# EAGLE schematic cat_detector (EAGLE 9.6.2)
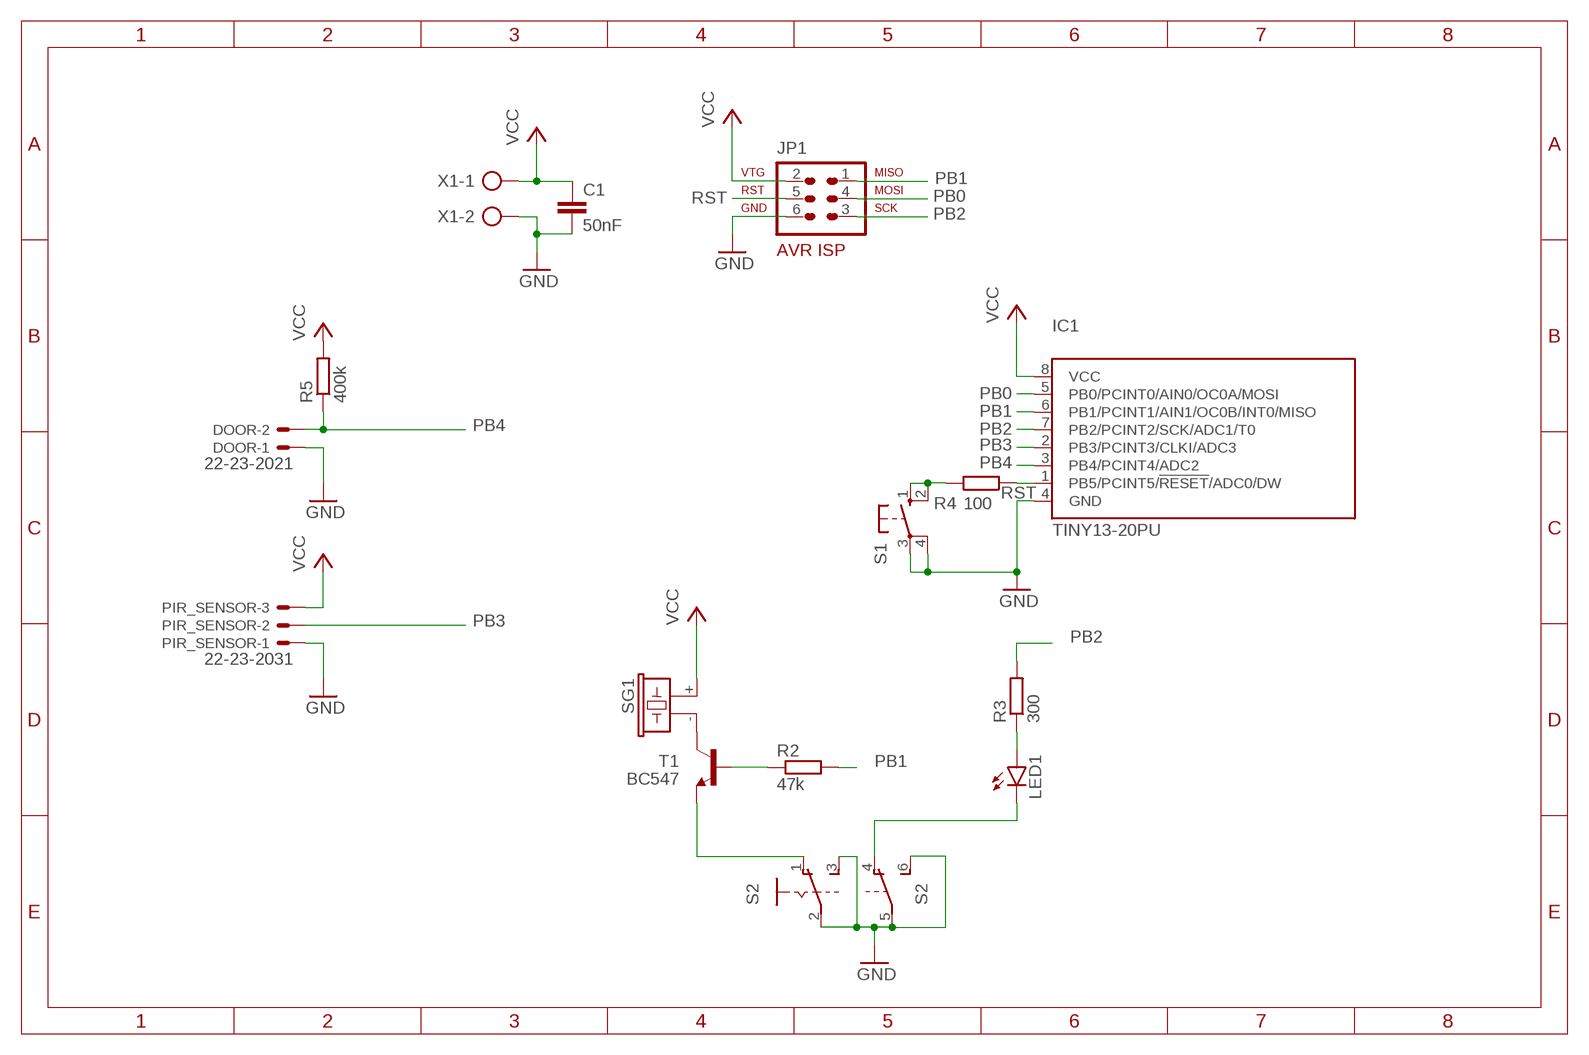
[diagram p0: schematic, sheet 1]

## Parts
C1  50nF  C2.5/2  [C2.5-2]
DOOR  22-23-2021  [22-23-2021]
IC1  TINY13-20PU  [DIL08]
JP1  AVR-ISP-6  [AVR-ISP-6]
LED1  LED5MM  [LED5MM]
PIR_SENSOR  22-23-2031  [22-23-2031]
R2  47k  R-EU_0204/7  [0204/7]
R3  300  R-EU_0204/7  [0204/7]
R4  100  R-EU_0204/7  [0204/7]
R5  400k  R-EU_0204/7  [0204/7]
S1  10-XX  [B3F-10XX]
S2  A68-A31  [A68-A31]
SG1  F/CM12P  [F/CM12P]
T1  BC547  [TO92]
X1  CON-PTR500_AK300/2  [CON-PTR500_AK300/2]

## Nets
GND: C1.2 DOOR.1 IC1.4(GND) JP1.6 PIR_SENSOR.1 S1.3(P) S1.4(P1) S2.2(A:P) S2.3(A:S) S2.5(B:P) S2.6(B:S) X1.2
N$2: SG1.- T1.3(C)
N$3: R2.1 T1.2(B)
N$4: LED1.A R3.1
N$5: S2.1(A:O) T1.1(E)
N$6: LED1.K(C) S2.4(B:O)
PB0: IC1.5(PB0/PCINT0/AIN0/OC0A/MOSI) JP1.4
PB1: IC1.6(PB1/PCINT1/AIN1/OC0B/INT0/MISO) JP1.1 R2.2
PB2: IC1.7(PB2/PCINT2/SCK/ADC1/T0) JP1.3 R3.2
PB3: IC1.2(PB3/PCINT3/CLKI/ADC3) PIR_SENSOR.2
PB4: DOOR.2 IC1.3(PB4/PCINT4/ADC2) R5.1
RST: IC1.1(PB5/PCINT5/!RESET!/ADC0/DW) JP1.5 R4.1
RST1: R4.2 S1.1(S) S1.2(S1)
VCC: C1.1 IC1.8(VCC) JP1.2 PIR_SENSOR.3 R5.2 SG1.+ X1.1

## Library data of the parts
C1 = capacitor-wima:C: CAPACITOR naming: grid - package width
DOOR = con-molex:22-23-2021: .100" (2.54mm) Center Header - 2 Pin; MF: MOLEX; MPN: 22-23-2021; OC_FARNELL: 1462926; OC_NEWARK: 25C3832
IC1 = atmel:TINY13: 8-bit AVR Microcontroller with 1K Bytes In-System Programmable Flash Source: http://www.atmel.com/dyn/resources/prod_documents/2535S.pdf; MPN: ATTINY13-20PU; OC_FARNELL: 9171550; OC_NEWARK: 96K6521
JP1 = atmel:AVR-ISP-6: AVR ISP-6 Serial Programming Header
LED1 = led:LED: LED OSRAM: - CHIPLED LG R971, LG N971, LY N971, LG Q971, LY Q971, LO R971, LY R971 LH N974, LH R974 LS Q976, LO Q976, LY Q976 LO Q996 - Hyper CHIPLED LW Q18S LB Q993, LB Q99A, LB R99A - SideLED LS A670, LO A670, LY A670, LG A670, LP A670 LB A673, LV A673, LT A673, LW A673 LH A674 LY A675 LS A676, LA A676, LO A676, LY A676, LW A676 LS A679, LY A679, LG A679 - Hyper Micro SIDELED® LS Y876, LA Y876, LO Y876, LY Y876 LT Y87S - SmartLED LW L88C, LW L88S LB L89C, LB L89S, LG L890 LS L89K, LO L89K, LY L89K LS L896, LA L896, LO L896, LY L896 - TOPLED LS T670, LO T670, LY T670, LG T670, LP T670 LSG T670, LSP T670, LSY T670, LOP T670, LYG T670 LG T671, LOG T671, LSG T671 LB T673, LV T673, LT T673, LW T673 LH T674 LS T676, LA T676, LO T676, LY T676, LB T676, LH T676, LSB T676, LW T676 LB T67C, LV T67C, LT T67C, LS T67K, LO T67K, LY T67K, LW E67C LS E67B, LA E67B, LO E67B, LY E67B, LB E67C, LV E67C, LT E67C LW T67C LS T679, LY T679, LG T679 LS T770, LO T770, LY T770, LG T770, LP T770 LB T773, LV T773, LT T773, LW T773 LH T774 LS E675, LA E675, LY E675, LS T675 LS T776, LA T776, LO T776, LY T776, LB T776 LHGB T686 LT T68C, LB T68C - Hyper Mini TOPLED® LB M676 - Mini TOPLED Santana® LG M470 LS M47K, LO M47K, LY M47K Source: http://www.osram.convergy.de LUXEON: - LUMILED® LXK2-PW12-R00, LXK2-PW12-S00, LXK2-PW14-U00, LXK2-PW14-V00 LXK2-PM12-R00, LXK2-PM12-S00, LXK2-PM14-U00 LXK2-PE12-Q00, LXK2-PE12-R00, LXK2-PE12-S00, LXK2-PE14-T00, LXK2-PE14-U00 LXK2-PB12-K00, LXK2-PB12-L00, LXK2-PB12-M00, LXK2-PB14-N00, LXK2-PB14-P00, LXK2-PB14-Q00 LXK2-PR12-L00, LXK2-PR12-M00, LXK2-PR14-Q00, LXK2-PR14-R00 LXK2-PD12-Q00, LXK2-PD12-R00, LXK2-PD12-S00 LXK2-PH12-R00, LXK2-PH12-S00 LXK2-PL12-P00, LXK2-PL12-Q00, LXK2-PL12-R00 Source: www.luxeon.com KINGBRIGHT: KA-3528ASYC Source: www.kingbright.com
PIR_SENSOR = con-molex:22-23-2031: .100" (2.54mm) Center Header - 3 Pin; MF: MOLEX; MPN: 22-23-2031; OC_FARNELL: 1462950; OC_NEWARK: 30C0862
R2-R5 = rcl:R-EU_: RESISTOR, European symbol; SPICEPREFIX: R
S1 = MYswitch-omron:10-XX: OMRON SWITCH; MPN: B3F-1000; OC_FARNELL: 176432; OC_NEWARK: 36M3542
S2 = switch:A68-A31: SLIDING SWITCH Siemens, distributor Buerklin, 11G766
SG1 = buzzer:F/CM12P: BUZZER Source: Buerklin; OC_FARNELL: unknown; OC_NEWARK: unknown
T1 = transistor:BC547: NPN TRANSISTOR
X1 = Marcin.Żmuda:CON-PTR500_AK300/2: CONNECTOR; OC_FARNELL: unknown; OC_NEWARK: unknown